# Altium project AMC_FMC_Carrier v4.PrjPcb (part 17 of 18)

## Sheet CPU.SchDoc: AMC FMC Carrier v4
size 420 x 297 mm; CompanyName: WUT; Organization: WUT ISE; Address1: Warsaw Univeristy of Technology; Address2: Nowowiejska 15/19 00-665 Warsaw; Address3: t.przywozki@gmail.com; Revision: 1; SheetNumber: 18; SheetTotal: 29; Project: AMC FMC Carrier v4; ModifiedBy: -; CheckedDate: -; Title2: MMC; DivGrp: ISE; Designer: T. Przywozki; ModifiedDate: -; ProjectName: ADC/DAC MEZZANINE
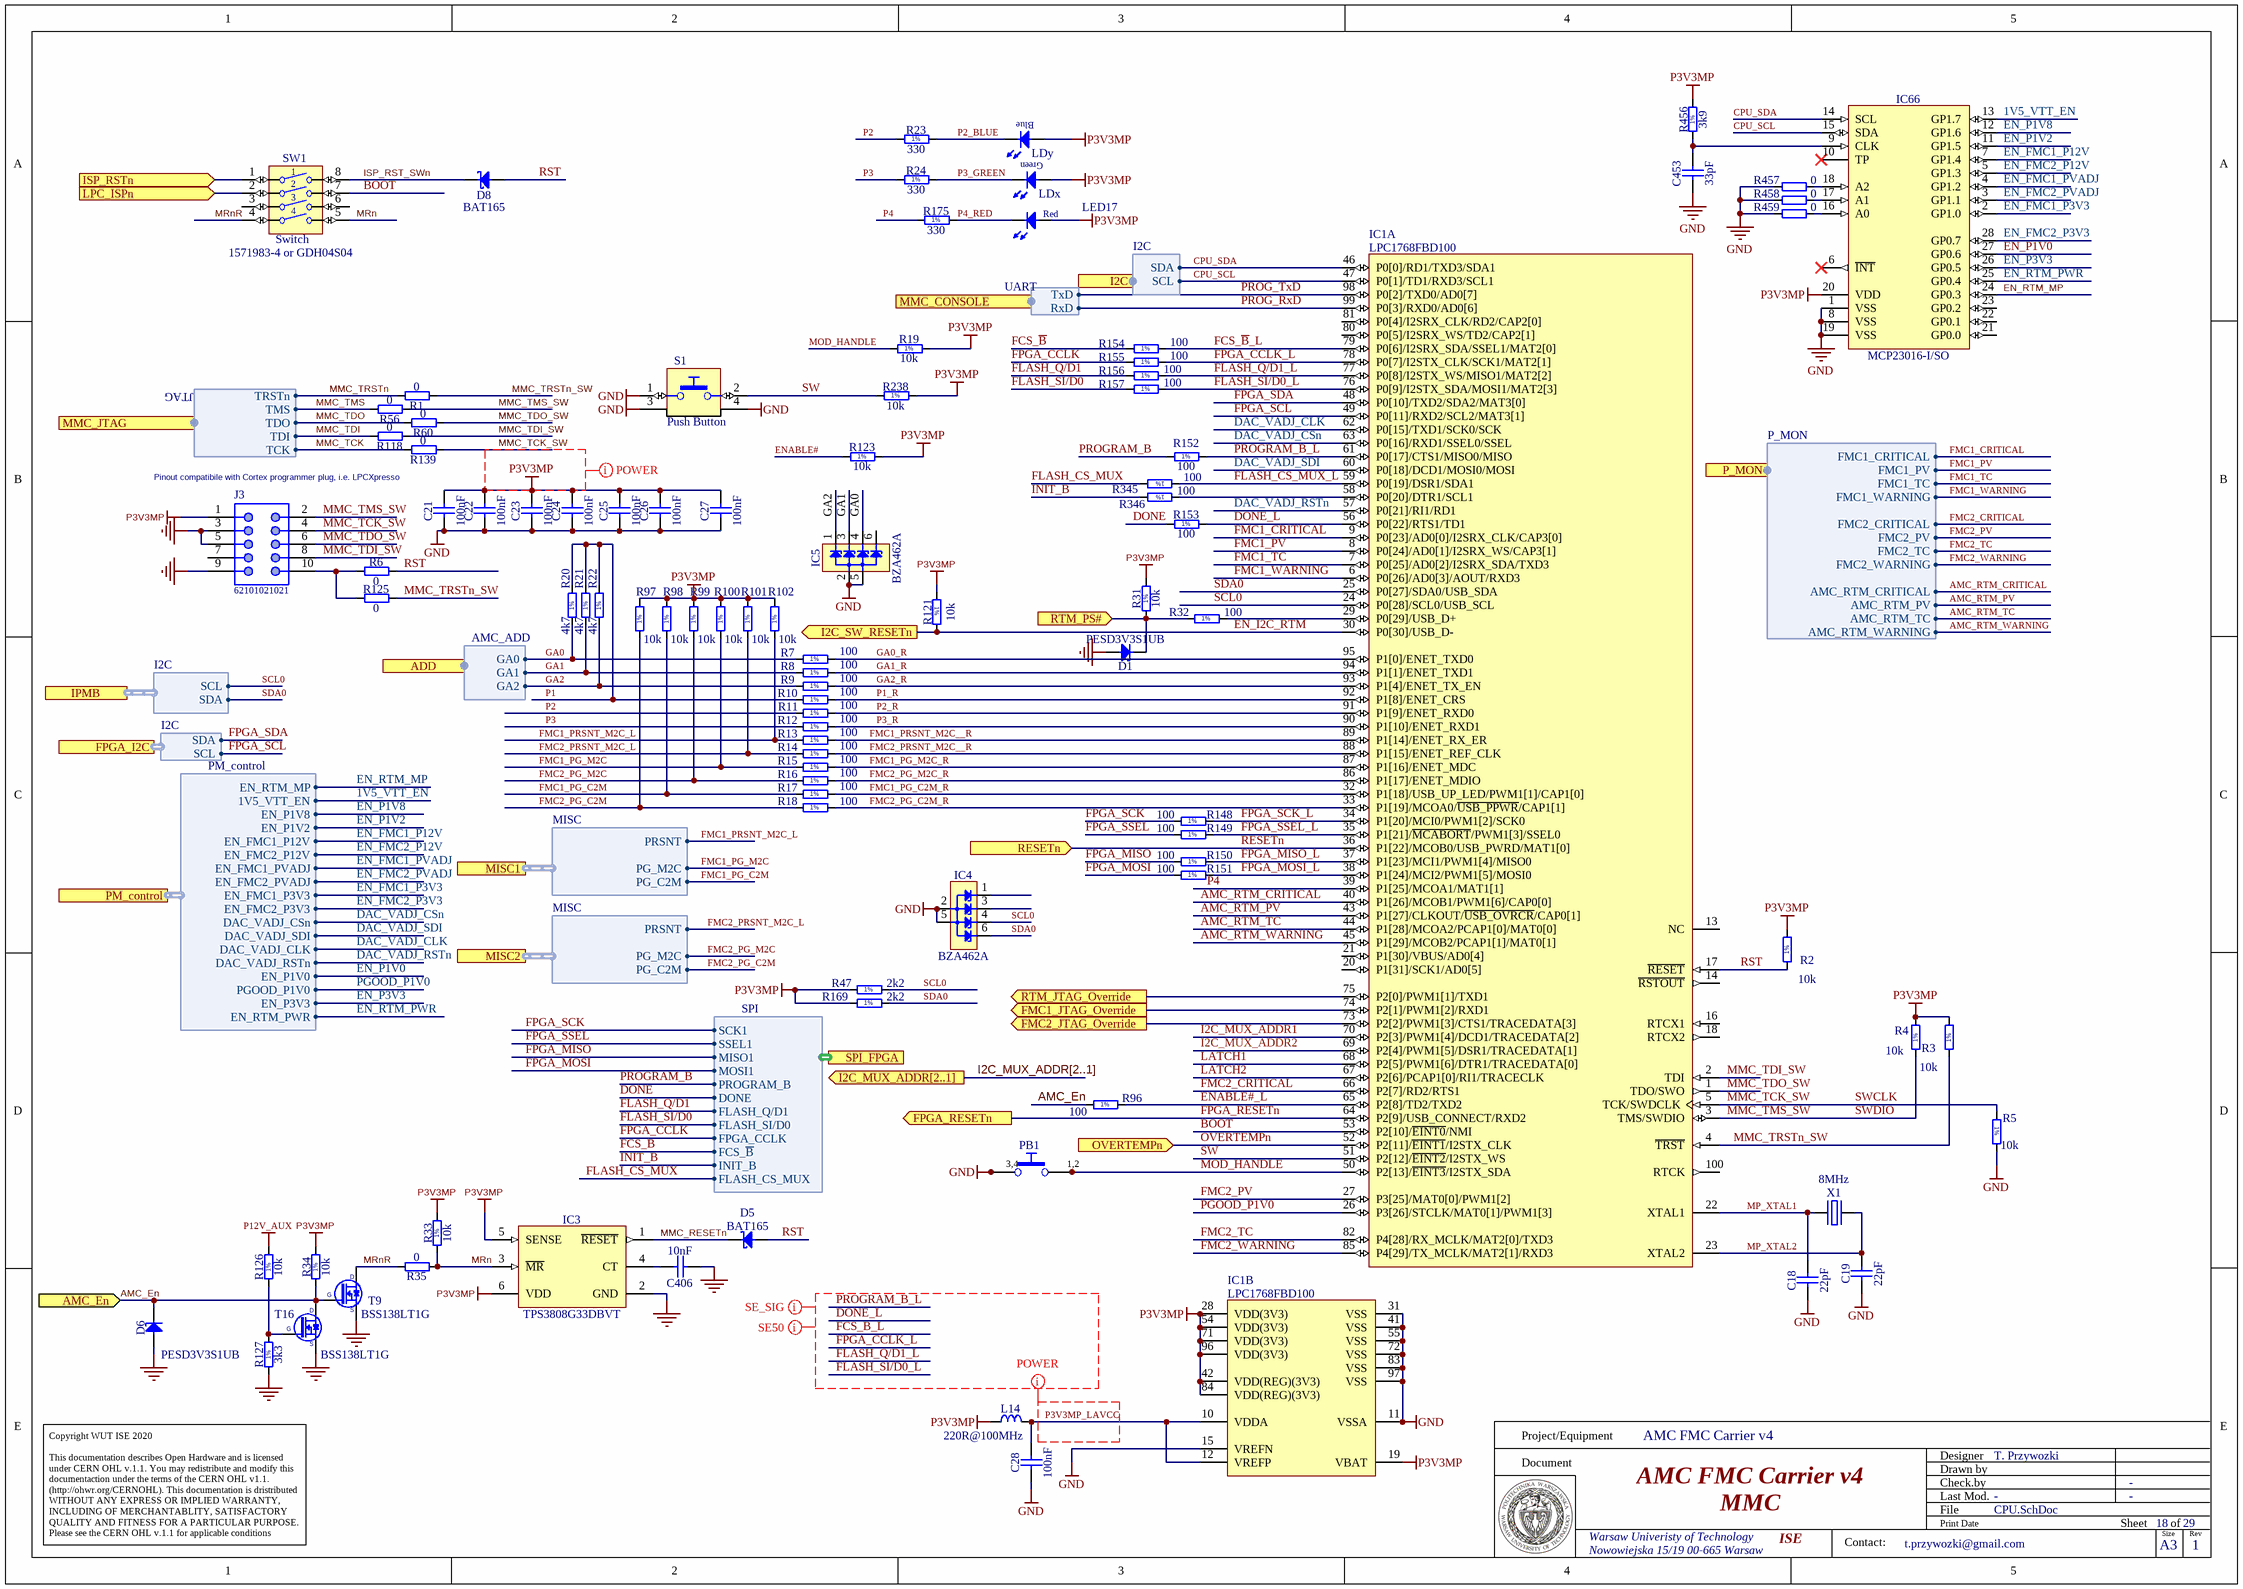
[diagram p30: CPU.SchDoc]

### Parts
(Parts that share a designator on the sheet are numbered #1, #2 ... from top to bottom, then left to right.)
C18  22pF  [CAPC1005X55N]
C19  22pF  [CAPC1005X55N]
C21  100nF  [CAPC0603X33N]
C22  100nF  [CAPC0603X33N]
C23  100nF  [CAPC0603X33N]
C24  100nF  [CAPC0603X33N]
C25  100nF  [CAPC0603X33N]
C26  100nF  [CAPC0603X33N]
C27  100nF  [CAPC0603X33N]
C28  100nF  [CAPC0603X33N]
C406  10nF  [CAPC1005X55N]
C453#2  33pF  [CAPC1005X55N]
D1  PESD3V3S1UB  [SODFL1608X65N]
D5  BAT165  [SOD2512X110N]
D6  PESD3V3S1UB  [SODFL1608X65N]
D8  BAT165  [SOD2512X110N]
IC1  LPC1768FBD100  [QFP50P1600X1600X160-100N]  (parts A,B of 2)
IC3  TPS3808G33DBVT  [SOT95P280X145-6N]
IC4  BZA462A  [SOT95P275X110-6N]
IC5  BZA462A  [SOT95P275X110-6N]
IC66  MCP23016-I/SO  [SOIC127P1030X265-28N]
J3  62101021021  [62101021021]
L14  220R@100MHz  [INDC2012X105N]
LDx  Green  [LED_AVAGO_HSME-C120rev]  (value not drawn)
LDy  Blue  [LED_AVAGO_HSME-C120rev]  (value not drawn)
LED17  Red  [LED_KINGBRIGHT_KPH-1608SURCK]
PB1  Push Button  [SW_C&K_HDT0001]  (value not drawn)
R1  0  [RESC1005X40N]
R2  10k  [RESC1005X40N]
R3  10k  [RESC1005X40N]
R4  10k  [RESC1005X40N]
R5  10k  [RESC1005X40N]
R6  0  [RESC1005X40N]
R7  100  [RESC1005X40N]
R8  100  [RESC1005X40N]
R9  100  [RESC1005X40N]
R10  100  [RESC1005X40N]
R11  100  [RESC1005X40N]
R12  100  [RESC1005X40N]
R13  100  [RESC1005X40N]
R14  100  [RESC1005X40N]
R15  100  [RESC1005X40N]
R16  100  [RESC1005X40N]
R17  100  [RESC1005X40N]
R18  100  [RESC1005X40N]
R19  10k  [RESC1005X40N]
R20  4k7  [RESC1005X40N]
R21  4k7  [RESC1005X40N]
R22  4k7  [RESC1005X40N]
R23  330  [RESC1005X40N]
R24  330  [RESC1005X40N]
R31  10k  [RESC1005X40N]
R32  100  [RESC1005X40N]
R33  10k  [RESC1005X40N]
R34  10k  [RESC1005X40N]
R35  0  [RESC1005X40N]
R47  2k2  [RESC1005X40N]
R56  0  [RESC1005X40N]
R60  0  [RESC1005X40N]
R96  100  [RESC1005X40N]
R97  10k  [RESC1005X40N]
R98  10k  [RESC1005X40N]
R99  10k  [RESC1005X40N]
R100  10k  [RESC1005X40N]
R101  10k  [RESC1005X40N]
R102  10k  [RESC1005X40N]
R118  0  [RESC1005X40N]
R121  10k  [RESC1005X40N]
R123  10k  [RESC1005X40N]
R125  0  [RESC1005X40N]
R126  10k  [RESC1005X40N]
R127  3k3  [RESC1608X55N]
R139  0  [RESC1005X40N]
R148  100  [RESC1005X40N]
R149  100  [RESC1005X40N]
R150  100  [RESC1005X40N]
R151  100  [RESC1005X40N]
R152  100  [RESC1005X40N]
R153  100  [RESC1005X40N]
R154  100  [RESC1005X40N]
R155  100  [RESC1005X40N]
R156  100  [RESC1005X40N]
R157  100  [RESC1005X40N]
R169  2k2  [RESC1005X40N]
R175  330  [RESC1005X40N]
R238  10k  [RESC1005X40N]
R345  100  [RESC1005X40N]
R346  100  [RESC1005X40N]
R456  3k9  [RESC1005X40N]
R457  0  [RESC1005X40N]
R458  0  [RESC1005X40N]
R459  0  [RESC1005X40N]
S1  Push Button  [PB_ALPS_SKHHLQA010]
SW1  Switch  Manufacturer Part Number: 1571983-4 or GDH04S04  [SW_TYCO_1571983-4]
T9  BSS138LT1G  [SOT95P240X110-3N]
T16  BSS138LT1G  [SOT95P240X110-3N]
X1  8MHz  [XTAL_TXC_7A]

### Ports
ADD (harness AMC_ADD), AMC_En (in), FMC1_JTAG_Override (out), FMC2_JTAG_Override (out), FPGA_I2C (harness I2C), FPGA_RESETn (out), I2C (harness I2C), I2C_MUX_ADDR[2..1] (out), I2C_SW_RESETn (out), IPMB (harness I2C), ISP_RSTn (in), LPC_ISPn (in), MISC1 (harness MISC), MISC2 (harness MISC), MMC_CONSOLE (harness UART), MMC_JTAG (harness JTAG), OVERTEMPn (in), P_MON (harness P_MON), PM_control (harness PM_control), RESETn (in), RTM_JTAG_Override (out), RTM_PS# (in), SPI_FPGA (harness SPI)

### Harnesses
SPI: SCK1, SSEL1, MISO1, MOSI1, FLASH_Q/D1, FLASH_SI/D0, PROGRAM_B, DONE, FPGA_CCLK, FCS_~{B}, INIT_B, FLASH_CS_MUX
PM_control: EN_P1V8, EN_P1V2, EN_FMC1_P12V, EN_FMC2_P12V, EN_FMC1_PVADJ, EN_FMC2_PVADJ, EN_FMC1_P3V3, EN_FMC2_P3V3, DAC_VADJ_CSn, DAC_VADJ_SDI, DAC_VADJ_CLK, DAC_VADJ_RSTn, 1V5_VTT_EN, EN_P1V0, PGOOD_P1V0, EN_P3V3, EN_RTM_PWR, EN_RTM_MP
I2C: SCL, SDA
MISC: PRSNT, PG_M2C, PG_C2M
AMC_ADD: GA0, GA1, GA2
JTAG: TCK, TDI, TDO, TMS, TRSTn
UART: RxD, TxD
P_MON: FMC1_CRITICAL, FMC1_TC, FMC1_WARNING, AMC_RTM_CRITICAL, FMC2_WARNING, AMC_RTM_PV, FMC2_CRITICAL, AMC_RTM_TC, FMC2_PV, AMC_RTM_WARNING, FMC2_TC, FMC1_PV

### Nets
GND: C18.1 C19.1 C21.1 C22.1 C23.1 C24.1 C25.1 C26.1 C27.1 C28.2 C406.1 C453#2.1 D1.2(A) D6.2(A) IC1.11(VSSA) IC1.15(VREFN) IC1.31(VSS) IC1.41(VSS) IC1.55(VSS) IC1.72(VSS) IC1.83(VSS) IC1.97(VSS) IC3.2(GND) IC4.2(A) IC4.5(A) IC5.2(A) IC5.5(A) IC66.1(VSS) IC66.8(VSS) IC66.19(VSS) J3.3 J3.5 J3.9 PB1.3 PB1.4 R5.1 R127.1 R457.1 R458.1 R459.1 S1.1 S1.3 S1.4 T9.2(S) T16.2(S)
P3V3MP: C21.2 C22.2 C23.2 C24.2 C25.2 C26.2 C27.2 IC1.19(VBAT) IC1.28(VDD(3V3)) IC1.42(VDD(REG)(3V3)) IC1.54(VDD(3V3)) IC1.71(VDD(3V3)) IC1.84(VDD(REG)(3V3)) IC1.96(VDD(3V3)) IC3.5(SENSE) IC3.6(VDD) IC66.20(VDD) J3.1 L14.2 LDx.1(A) LDy.1(A) LED17.2(A) R2.2 R3.2 R4.2 R19.2 R31.2 R33.2 R34.2 R47.1 R97.2 R98.2 R99.2 R100.2 R101.2 R102.2 R121.1 R123.2 R169.1 R238.2 R456.2
P12V_AUX: R126.2
1V5_VTT_EN: IC66.13(GP1.7) ; port PM_control.1V5_VTT_EN  [project net PM.1V5_VTT_EN]
AMC_En: D6.1(C) R34.1 R96.1 T9.1(G) T16.3(D) ; port AMC_En  [project net SCN_ENn]
AMC_RTM_CRITICAL: IC1.40(P1[26]/MCOB1/PWM1[6]/CAP0[0]) ; port P_MON.AMC_RTM_CRITICAL
AMC_RTM_PV: IC1.43(P1[27]/CLKOUT/~{USB_OVRCR}/CAP0[1]) ; port P_MON.AMC_RTM_PV
AMC_RTM_TC: IC1.44(P1[28]/MCOA2/PCAP1[0]/MAT0[0]) ; port P_MON.AMC_RTM_TC
AMC_RTM_WARNING: IC1.45(P1[29]/MCOB2/PCAP1[1]/MAT0[1]) ; port P_MON.AMC_RTM_WARNING
BOOT: IC1.53(P2[10]/~{EINT0}/NMI) SW1.7
CPU_SCL: IC1.47(P0[1]/TD1/RXD3/SCL1) IC66.15(SDA) ; port I2C.SCL  [project net I2C_CPU.SCL]
CPU_SDA: IC1.46(P0[0]/RD1/TXD3/SDA1) IC66.14(SCL) ; port I2C.SDA  [project net I2C_CPU.SDA]
DAC_VADJ_CLK: IC1.62(P0[15]/TXD1/SCK0/SCK) ; port PM_control.DAC_VADJ_CLK  [project net PM.DAC_VADJ_CLK]
DAC_VADJ_CSn: IC1.63(P0[16]/RXD1/SSEL0/SSEL) ; port PM_control.DAC_VADJ_CSn  [project net PM.DAC_VADJ_CSn]
DAC_VADJ_RSTn: IC1.57(P0[21]/RI1/RD1) ; port PM_control.DAC_VADJ_RSTn  [project net PM.DAC_VADJ_RSTn]
DAC_VADJ_SDI: IC1.60(P0[18]/DCD1/MOSI0/MOSI) ; port PM_control.DAC_VADJ_SDI  [project net PM.DAC_VADJ_SDI]
DONE: R153.2 ; port SPI_FPGA.DONE  [project net FSPI.DONE]
DONE_L: IC1.56(P0[22]/RTS1/TD1) R153.1
EN_FMC1_P3V3: IC66.2(GP1.0) ; port PM_control.EN_FMC1_P3V3  [project net PM.EN_FMC1_P3V3]
EN_FMC1_P12V: IC66.7(GP1.4) ; port PM_control.EN_FMC1_P12V  [project net PM.EN_FMC1_P12V]
EN_FMC1_PVADJ: IC66.4(GP1.2) ; port PM_control.EN_FMC1_PVADJ  [project net PM.EN_FMC1_PVADJ]
EN_FMC2_P3V3: IC66.28(GP0.7) ; port PM_control.EN_FMC2_P3V3  [project net PM.EN_FMC2_P3V3]
EN_FMC2_P12V: IC66.5(GP1.3) ; port PM_control.EN_FMC2_P12V  [project net PM.EN_FMC2_P12V]
EN_FMC2_PVADJ: IC66.3(GP1.1) ; port PM_control.EN_FMC2_PVADJ  [project net PM.EN_FMC2_PVADJ]
EN_I2C_RTM: IC1.30(P0[30]/USB_D-) R121.2 ; port I2C_SW_RESETn
EN_P1V0: IC66.27(GP0.6) ; port PM_control.EN_P1V0  [project net PM.EN_P1V0]
EN_P1V2: IC66.11(GP1.5) ; port PM_control.EN_P1V2  [project net PM.EN_P1V2]
EN_P1V8: IC66.12(GP1.6) ; port PM_control.EN_P1V8  [project net PM.EN_P1V8]
EN_P3V3: IC66.26(GP0.5) ; port PM_control.EN_P3V3  [project net PM.EN_P3V3]
EN_RTM_MP: IC66.24(GP0.3) ; port PM_control.EN_RTM_MP  [project net PM.EN_RTM_MP]
EN_RTM_PWR: IC66.25(GP0.4) ; port PM_control.EN_RTM_PWR  [project net PM.EN_RTM_PWR]
ENABLE#: R123.1
ENABLE#_L: IC1.65(P2[8]/TD2/TXD2) R96.2
FCS_~{B}: R154.1 ; port SPI_FPGA.FCS_~{B}  [project net FSPI.FCS_~{B}]
FCS_~{B}_L: IC1.79(P0[6]/I2SRX_SDA/SSEL1/MAT2[0]) R154.2
FLASH_CS_MUX: R345.1 ; port SPI_FPGA.FLASH_CS_MUX  [project net FSPI.FLASH_CS_MUX]
FLASH_CS_MUX_L: IC1.59(P0[19]/DSR1/SDA1) R345.2
FLASH_Q/D1: R156.1 ; port SPI_FPGA.FLASH_Q/D1  [project net FSPI.FLASH_Q/D1]
FLASH_Q/D1_L: IC1.77(P0[8]/I2STX_WS/MISO1/MAT2[2]) R156.2
FLASH_SI/D0: R157.1 ; port SPI_FPGA.FLASH_SI/D0  [project net FSPI.FLASH_SI/D0]
FLASH_SI/D0_L: IC1.76(P0[9]/I2STX_SDA/MOSI1/MAT2[3]) R157.2
FMC1_CRITICAL: IC1.9(P0[23]/AD0[0]/I2SRX_CLK/CAP3[0]) ; port P_MON.FMC1_CRITICAL
FMC1_JTAG_Override: IC1.74(P2[1]/PWM1[2]/RXD1) ; port FMC1_JTAG_Override
FMC1_PG_C2M: R17.1 R98.1 ; port MISC1.PG_C2M  [project net MISC1.PG_C2M]
FMC1_PG_C2M_R: IC1.32(P1[18]/USB_UP_LED/PWM1[1]/CAP1[0]) R17.2
FMC1_PG_M2C: R15.1 R100.1 ; port MISC1.PG_M2C  [project net MISC1.PG_M2C]
FMC1_PG_M2C_R: IC1.87(P1[16]/ENET_MDC) R15.2
FMC1_PRSNT_M2C__R: IC1.89(P1[14]/ENET_RX_ER) R13.2
FMC1_PRSNT_M2C_L: R13.1 R102.1 ; port MISC1.PRSNT  [project net MISC1.PRSNT]
FMC1_PV: IC1.8(P0[24]/AD0[1]/I2SRX_WS/CAP3[1]) ; port P_MON.FMC1_PV
FMC1_TC: IC1.7(P0[25]/AD0[2]/I2SRX_SDA/TXD3) ; port P_MON.FMC1_TC
FMC1_WARNING: IC1.6(P0[26]/AD0[3]/AOUT/RXD3) ; port P_MON.FMC1_WARNING
FMC2_CRITICAL: IC1.66(P2[7]/RD2/RTS1) ; port P_MON.FMC2_CRITICAL
FMC2_JTAG_Override: IC1.73(P2[2]/PWM1[3]/CTS1/TRACEDATA[3]) ; port FMC2_JTAG_Override
FMC2_PG_C2M: R18.1 R97.1 ; port MISC2.PG_C2M  [project net MISC2.PG_C2M]
FMC2_PG_C2M_R: IC1.33(P1[19]/MCOA0/~{USB_PPWR}/CAP1[1]) R18.2
FMC2_PG_M2C: R16.1 R99.1 ; port MISC2.PG_M2C  [project net MISC2.PG_M2C]
FMC2_PG_M2C_R: IC1.86(P1[17]/ENET_MDIO) R16.2
FMC2_PRSNT_M2C__R: IC1.88(P1[15]/ENET_REF_CLK) R14.2
FMC2_PRSNT_M2C_L: R14.1 R101.1 ; port MISC2.PRSNT  [project net MISC2.PRSNT]
FMC2_PV: IC1.27(P3[25]/MAT0[0]/PWM1[2]) ; port P_MON.FMC2_PV
FMC2_TC: IC1.82(P4[28]/RX_MCLK/MAT2[0]/TXD3) ; port P_MON.FMC2_TC
FMC2_WARNING: IC1.85(P4[29]/TX_MCLK/MAT2[1]/RXD3) ; port P_MON.FMC2_WARNING
FPGA_CCLK: R155.1 ; port SPI_FPGA.FPGA_CCLK  [project net FSPI.FPGA_CCLK]
FPGA_CCLK_L: IC1.78(P0[7]/I2STX_CLK/SCK1/MAT2[1]) R155.2
FPGA_MISO: R150.2 ; port SPI_FPGA.MISO1  [project net FSPI.MISO1]
FPGA_MISO_L: IC1.37(P1[23]/MCI1/PWM1[4]/MISO0) R150.1
FPGA_MOSI: R151.2 ; port SPI_FPGA.MOSI1  [project net FSPI.MOSI1]
FPGA_MOSI_L: IC1.38(P1[24]/MCI2/PWM1[5]/MOSI0) R151.1
FPGA_RESETn: IC1.64(P2[9]/USB_CONNECT/RXD2) ; port FPGA_RESETn
FPGA_SCK: R148.2 ; port SPI_FPGA.SCK1  [project net FSPI.SCK1]
FPGA_SCK_L: IC1.34(P1[20]/MCI0/PWM1[2]/SCK0) R148.1
FPGA_SCL: IC1.49(P0[11]/RXD2/SCL2/MAT3[1]) ; port FPGA_I2C.SCL  [project net FPGA_I2C_SCL]
FPGA_SDA: IC1.48(P0[10]/TXD2/SDA2/MAT3[0]) ; port FPGA_I2C.SDA  [project net FPGA_I2C_SDA]
FPGA_SSEL: R149.2 ; port SPI_FPGA.SSEL1  [project net FSPI.SSEL1]
FPGA_SSEL_L: IC1.35(P1[21]/~{MCABORT}/PWM1[3]/SSEL0) R149.1
GA0: IC5.4(C3) R7.1 R20.1 ; port ADD.GA0  [project net ADD.GA0]
GA0_R: IC1.95(P1[0]/ENET_TXD0) R7.2
GA1: IC5.3(C2) R8.1 R21.1 ; port ADD.GA1  [project net ADD.GA1]
GA1_R: IC1.94(P1[1]/ENET_TXD1) R8.2
GA2: IC5.1(C1) R9.1 R22.1 ; port ADD.GA2  [project net ADD.GA2]
GA2_R: IC1.93(P1[4]/ENET_TX_EN) R9.2
I2C_MUX_ADDR1: IC1.70(P2[3]/PWM1[4]/DCD1/TRACEDATA[2])
I2C_MUX_ADDR2: IC1.69(P2[4]/PWM1[5]/DSR1/TRACEDATA[1])
INIT_B: R346.1 ; port SPI_FPGA.INIT_B  [project net FSPI.INIT_B]
ISP_RST_SWn: D8.1(C) SW1.8
ISP_RSTn: SW1.1 ; port ISP_RSTn
LATCH1: IC1.68(P2[5]/PWM1[6]/DTR1/TRACEDATA[0])
LATCH2: IC1.67(P2[6]/PCAP1[0]/RI1/TRACECLK)
LPC_ISPn: SW1.2 ; port LPC_ISPn
MMC_RESETn: D5.1(C) IC3.1(~{RESET})
MMC_TCK: R139.2 ; port MMC_JTAG.TCK
MMC_TCK_SW: IC1.5(TCK/SWDCLK) J3.4 R5.2 R139.1  [also labelled SWCLK]
MMC_TDI: R118.2 ; port MMC_JTAG.TDI
MMC_TDI_SW: IC1.2(TDI) J3.8 R118.1
MMC_TDO: R60.2 ; port MMC_JTAG.TDO
MMC_TDO_SW: IC1.1(TDO/SWO) J3.6 R60.1
MMC_TMS: R56.2 ; port MMC_JTAG.TMS
MMC_TMS_SW: IC1.3(TMS/SWDIO) J3.2 R4.1 R56.1  [also labelled SWDIO]
MMC_TRSTn: R1.2 ; port MMC_JTAG.TRSTn
MMC_TRSTn_SW: IC1.4(~{TRST}) R1.1 R3.1 R125.2
MOD_HANDLE: IC1.50(P2[13]/~{EINT3}/I2STX_SDA) PB1.1 PB1.2 R19.1
MP_XTAL1: C18.2 IC1.22(XTAL1) X1.1(OSC1)
MP_XTAL2: C19.2 IC1.23(XTAL2) X1.2(OSC2)
MRn: IC3.3(~{MR}) R33.1 R35.1 SW1.5
MRnR: R35.2 SW1.4 T9.3(D)
OVERTEMPn: IC1.52(P2[11]/~{EINT1}/I2STX_CLK) ; port OVERTEMPn
P1: R10.1 R20.2 R21.2 R22.2
P1_R: IC1.92(P1[8]/ENET_CRS) R10.2
P2: R11.1 R23.1
P2_BLUE: LDy.2(C) R23.2
P2_R: IC1.91(P1[9]/ENET_RXD0) R11.2
P3: R12.1 R24.1
P3_GREEN: LDx.2(C) R24.2
P3_R: IC1.90(P1[10]/ENET_RXD1) R12.2
P3V3MP_LAVCC: C28.1 IC1.10(VDDA) IC1.12(VREFP) L14.1
P4: IC1.39(P1[25]/MCOA1/MAT1[1]) R175.1
P4_RED: LED17.1(C) R175.2
PGOOD_P1V0: IC1.26(P3[26]/STCLK/MAT0[1]/PWM1[3]) ; port PM_control.PGOOD_P1V0  [project net PM.PGOOD_P1V0]
PROG_RxD: IC1.99(P0[3]/RXD0/AD0[6]) ; port MMC_CONSOLE.RxD  [project net MMC_CONS_PROG_RxD]
PROG_TxD: IC1.98(P0[2]/TXD0/AD0[7]) ; port MMC_CONSOLE.TxD  [project net MMC_CONS_PROG_TxD]
PROGRAM_B: R152.2 ; port SPI_FPGA.PROGRAM_B  [project net FSPI.PROGRAM_B]
PROGRAM_B_L: IC1.61(P0[17]/CTS1/MISO0/MISO) R152.1
RESETn: IC1.36(P1[22]/MCOB0/USB_PWRD/MAT1[0]) ; port RESETn
RST: D5.2(A) D8.2(A) IC1.17(~{RESET}) R2.1 R6.2
RTM_JTAG_Override: IC1.75(P2[0]/PWM1[1]/TXD1) ; port RTM_JTAG_Override
RTM_PS#: D1.1(C) R31.1 R32.2 ; port RTM_PS#
SCL0: IC1.24(P0[28]/SCL0/USB_SCL) IC4.4(C3) R47.2 ; port IPMB.SCL  [project net IPMB.SCL]
SDA0: IC1.25(P0[27]/SDA0/USB_SDA) IC4.6(C4) R169.2 ; port IPMB.SDA  [project net IPMB.SDA]
SW: IC1.51(P2[12]/~{EINT2}/I2STX_WS) R238.1 S1.2
NetC406_2: C406.2 IC3.4(CT)
NetC453#2_2: C453#2.2 IC66.9(CLK) R456.1
NetIC1_29: IC1.29(P0[29]/USB_D+) R32.1
NetIC1_58: IC1.58(P0[20]/DTR1/SCL1) R346.2
NetIC66_16: IC66.16(A0) R459.2
NetIC66_17: IC66.17(A1) R458.2
NetIC66_18: IC66.18(A2) R457.2
NetJ3_10: J3.10 R6.1 R125.1
NetR126_1: R126.1 R127.2 T16.1(G)

Not connected (* = marked no-connect by the designer): IC1 13(NC) 14(~{RSTOUT}) 16(RTCX1) 18(RTCX2) 20(P1[31]/SCK1/AD0[5]) 21(P1[30]/VBUS/AD0[4]) 80(P0[5]/I2SRX_WS/TD2/CAP2[1]) 81(P0[4]/I2SRX_CLK/RD2/CAP2[0]) 100(RTCK); IC4 1(C1) 3(C2); IC5 6(C4); IC66 6(~{INT})* 10(TP)* 21(GP0.0) 22(GP0.1) 23(GP0.2); J3 7; SW1 3 6

### Buses and harness runs
bus I2C_MUX_ADDR[2..1] = port I2C_MUX_ADDR[2..1]

### Layout directives
net class POWER: MMC_TCK_SW, P3V3MP, P3V3MP_LAVCC
net class SE_SIG: DONE_L, FCS_~{B}_L, FLASH_Q/D1_L, FLASH_SI/D0_L, FPGA_CCLK_L, PROGRAM_B_L
net class SE50: DONE_L, FCS_~{B}_L, FLASH_Q/D1_L, FLASH_SI/D0_L, FPGA_CCLK_L, PROGRAM_B_L

### Notes on the sheet
- Pinout compatibile with Cortex programmer plug, i.e. LPCXpresso
- Project/Equipment
- Document
- Designer
- Drawn by
- Check.by
- Copyright WUT ISE 2020
  This documentation describes Open Hardware and is licensed under CERN OHL v.1.1. You may redistribute and modify this documentaction under the terms of the CERN OHL v1.1.
  (http://ohwr.org/CERNOHL). This documentation is dristributed WITHOUT ANY EXPRESS OR IMPLIED WARRANTY, INCLUDING OF MERCHANTABLITY, SATISFACTORY QUALITY AND FITNESS FOR A PARTICULAR PURPOSE. Please see the CERN OHL v.1.1 for applicable conditions
- File
- Last Mod.
- Print Date
- Sheet
- Size
- A3
- of
- Rev
- Contact:
- (in symbol R0402_2K2_1%_0.0625W_100PPM) 1%
- (in symbol R0402_3K9_1%_0.0625W_100PPM) 1%
- (in symbol R0402_4K7_1%_0.0625W_100PPM) 1%
- (in symbol R0402_10K_1%_0.0625W_100PPM) 1%
- (in symbol R0402_100R_1%_0.1W_100PPM) 1%
- (in symbol R0402_100R_1%_0.0625W_100PPM) 1%
- (in symbol R0402_330R_1%_0.0625W_100PPM) 1%
- (in symbol R0603_3K3_1%_0.1W_100PPM) 1%
- (in symbol SW_C&K_HDT0001) 3,4; 1,2

### Library data of the parts
C18 C19 = CC0402_22PF_50V_5%_NP0: Non-polarised capacitor; Part Description: SMD Multilayer Chip Ceramic Capacitor; Manufacturer: GENERIC; Manufacturer1 Part Number: 223886915229; Voltage: 50V; TC: NP0; Tolerance: ±5%; Table: Capacitors SMD; Part Number: CC0402_22PF_50V_5%_NP0; Component Kind: Standard; Component Type: Standard; Pin Count: 2; Value: 22pF; Status: Not Recommended; Manufacturer Part Number: CC0402_22PF_50V_5%_NP0; Case: 0402; Mounted: Yes; Socket: No; SMD: Yes; Manufacturer1 Example: PHYCOMP; Manufacturer1 ComponentHeight: 0.55mm; HelpURL: \\cern.ch\dfs\Applications\Altium\Datasheets\CC0402_NP0_PHYCOMP.pdf; Author: CERN DEM JLC; CreateDate: 2007-12-03; LatestRevisionDate: 2007-12-03
C21-C28 = CC0201_100NF_6.3V_10%_X5R: as C313-C317 on sheet Thermometers; Part Number: CC0201_100NF_6.3V_10%_X5R; Component Kind: Standard; Component Type: Standard; Pin Count: 2; Value: 100nF; Status: Not Recommended; Manufacturer Part Number: CC0201_100NF_6.3V_10%_X5R; Case: 0201; Mounted: Yes; Socket: No; SMD: Yes; Manufacturer1 Example: AVX; Manufacturer1 ComponentHeight: 0.33mm; HelpURL: \\cern.ch\dfs\Applications\Altium\Datasheets\CC0201_X5R_AVX.pdf; Author: CERN DEM JLC; CreateDate: 2007-12-03; LatestRevisionDate: 2007-12-03
C406 = CC0402_10NF_16V_10%_X7R: Non-polarised capacitor; Manufacturer: GENERIC; Part Description: SMD Multilayer Chip Ceramic Capacitor; Manufacturer1 Part Number: 223878715636; Tolerance: ±10%; Voltage: 16V; TC: X7R; Manufacturer Part Number: CC0402_10NF_16V_10%_X7R; Part Number: CC0402_10NF_16V_10%_X7R; Value: 10nF; Component Kind: Standard; Component Type: Standard; Pin Count: 2; Status: Not Recommended; Case: 0402; Mounted: Yes; Socket: No; SMD: Yes; Sense: No; Manufacturer1 Example: PHYCOMP; Manufacturer1 ComponentHeight: 0.55mm; HelpURL: \\cern.ch\dfs\Applications\Altium\Datasheets\CC0402_X7R_PHYCOMP.pdf; Author: CERN DEM JLC; CreateDate: 03.12.2007; LatestRevisionDate: 03.12.2007
C453#2 = CC0402_33PF_50V_5%_C0G: Non-polarised capacitor; Part Description: SMD Multilayer Chip Ceramic Capacitor; Manufacturer: GENERIC; Manufacturer1 Part Number: C0402C330J5GACTU; Voltage: 50V; TC: C0G/NP0; Tolerance: ±5%; Part Number: CC0402_33PF_50V_5%_C0G; Component Kind: Standard; Component Type: Standard; Pin Count: 2; Value: 33pF; Status: Preferred; Manufacturer Part Number: CC0402_33PF_50V_5%_C0G; Case: 0402; Mounted: Yes; Socket: No; SMD: Yes; Sense: No; Manufacturer1 Example: KEMET; Manufacturer1 ComponentHeight: 0.55mm; HelpURL: \\cern.ch\dfs\Applications\Altium\Datasheets\CC0402_C0G_KEMET_(Commercial Grade).pdf; Author: CERN DEM JLC; CreateDate: 03.12.2007; LatestRevisionDate: 22.04.2015
D1 D6 = PESD3V3S1UB: ESD protection diode; Manufacturer: NXP SEMICONDUCTORS; Part Description: ESD protection diode (23kV); Voltage: 3V3; Power: 330W; PressFit: No; Bonding: No; Manufacturer Part Number: PESD3V3S1UB; PackageDescription: Ultra Small Outline Diode Flat Lead (SOD-523), Body; 1.2mm L X 0.8mm W X 0.65mm H, IPC Medium Density; Part Number: PESD3V3S1UB; Component Kind: Standard; Component Type: Standard; Device: PESD3V3S1UB; Pin Count: 2; Case: SOD523; Mounted: Yes; Socket: No; SMD: Yes; Sense: No; ComponentHeight: 0.65mm; HelpURL: \\cern.ch\dfs\Applications\Altium\Datasheets\PESD3V3S1UB.pdf; Author: CERN DEM JLC; CreateDate: 29.11.2012; LatestRevisionDate: 29.11.2012
D5 D8 = BAT165: Schottky Diode; Manufacturer: INFINEON; Part Description: Medium Power AF Schottky Diode; Voltage: 40V; Power: 750mA; PressFit: No; Bonding: No; Manufacturer Part Number: BAT165; PackageDescription: Small Outline Diode (SOD-323), 1.70mm W X 1.25mm L X 1.10mm H body,  IPC Medium Density; Part Number: BAT165; Component Kind: Standard; Component Type: Standard; Device: BAT165; Pin Count: 2; Case: SOD323; Mounted: Yes; Socket: No; SMD: Yes; Sense: No; ComponentHeight: 1.1mm; HelpURL: \\cern.ch\dfs\Applications\Altium\Datasheets\BAT165.pdf; Author: CERN DEM JLC; CreateDate: 12.11.2014; LatestRevisionDate: 12.11.2014
IC1 = LPC1768FBD100: LPC1768 Series 64kB 100MHz 32-Bit ARM Cortex-M3 Microcontroller; Part Description: 32-bit 100MHz ARM Cortex-M3 Microcontroller, 512kB Flash, 64kB SRAM, with Ethernet, USB 2.0 Host/Device/OTG, CAN; Manufacturer: NXP SEMICONDUCTORS; PressFit: No; Bonding: No; Part Number: LPC1768FBD100; Component Kind: Standard; Component Type: Standard; Device: LPC1768FBD100; PackageDescription: QFP, 0.50mm Pitch, Square; 100 Pin,14.00mm L X 14.00mm W X 1.60mm H Body, IPC Medium Density; Manufacturer Part Number: LPC1768FBD100; Pin Count: 100; Case: QFP100; Mounted: Yes; Socket: No; SMD: Yes; Sense: No; ComponentHeight: 1.6mm; HelpURL: \\cern.ch\dfs\Applications\Altium\Datasheets\LPC1768FBD100.pdf; Author: CERN DEM JLC; CreateDate: 06.10.2016; LatestRevisionDate: 06.10.2016
IC3 = TPS3808G33DBVT: Low Quiescent Current, Programmable-Delay Supervisory Circuit; Manufacturer: TEXAS INSTRUMENTS; Part Description: 3.3V, Low Quiescent Current, Programmable-Delay Supervisory Circuit; PressFit: No; Bonding: No; Manufacturer Part Number: TPS3808G33DBVT; PackageDescription: SOT23, 6-Leads, Body 1.6x3.0mm, Pitch 0.95mm, IPC Medium Density; Part Number: TPS3808G33DBVT; Component Kind: Standard; Component Type: Standard; Device: TPS3808G33DBVT; Pin Count: 6; Case: SOT23-6; Mounted: Yes; Socket: No; SMD: Yes; Sense: No; ComponentHeight: 1.45mm; Author: CERN DEM JLC; HelpURL: \\cern.ch\dfs\Applications\Altium\Datasheets\TPS3808G33DBVT.pdf; CreateDate: 05.11.2013; LatestRevisionDate: 05.11.2013
IC4 IC5 = BZA462A: Quadruple ESD Transient Voltage Suppressor; Manufacturer: NXP SEMICONDUCTORS; Voltage: 15kV; Power: 24W; PressFit: No; Bonding: No; Part Number: BZA462A; Component Kind: Standard; Component Type: Standard; Device: BZA462A; PackageDescription: SOT, 0.95mm Pitch; 6 Pin, 1.50mm W X 2.90mm L X 1.10mm H body, IPC Medium Density; Part Description: Quadruple ESD Transient Voltage Suppressor; Manufacturer Part Number: BZA462A; Pin Count: 3; Case: SOT23-6; Mounted: Yes; Socket: No; SMD: Yes; Sense: No; ComponentHeight: 1.1mm; HelpURL: \\cern.ch\dfs\Applications\Altium\Datasheets\BZA462A.pdf; Author: CERN DEM JLC; CreateDate: 09.11.2016; LatestRevisionDate: 09.11.2016
IC66 = MCP23016-I/SO: 16-bit I/O I2C I/O Expander; Part Description: 16-bit I2C I/O Expander; Manufacturer: MICROCHIP TECHNOLOGY; PressFit: No; Bonding: No; Part Number: MCP23016-I/SO; Component Kind: Standard; Component Type: Standard; Device: MCP23016-I/SO; PackageDescription: SOIC,1.27mm, Pitch;28 Pin, 7.50mm W X 17.90mm L X 2.65mm H body, IPC Medium Density; Manufacturer Part Number: MCP23016-I/SO; Pin Count: 28; Case: SOIC28; Mounted: Yes; Socket: No; SMD: Yes; Sense: No; ComponentHeight: 2.65mm; Author: CERN DEM JLC; HelpURL: \\cern.ch\dfs\Applications\Altium\Datasheets\MCP23016-I-SO.pdf; CreateDate: 13.08.2012; LatestRevisionDate: 14.08.2012
J3 = 62101021021: SMT Vertical Pin Header WR-PHD, Pitch 1.27 mm, Dual Row, 10 pins; Pin Number: 10; Pitch: 1.27 mm; Gender: Male; Rated Current: 1 A; Working Voltage: 100 VAC; Withstanding Voltage: 500 VAC; Contact Resistance: 20 mOhm; ComponentLink1Description: Manufacturer; ComponentLink1URL: http://www.we-online.de; ComponentLink2Description: Datasheet; ComponentLink2URL: https://katalog.we-online.de/em/datasheet/62101021021.pdf; Part Number: 62101021021; Published Date: August 2018; Publisher: Wurth Elektronik; Operating Temperature: -40 to 105 degC; Mounting Technology: SMT; Packaging: Tube; Row Number: Dual; Orientation: Vertical
L14 = IND0805_MURATA_BLM21PG221SN1D: Inductor; Part Description: SMD EMIFIL Suppression Chip Ferrite Bead; Manufacturer: MURATA; Power: 2A; Resistance: 0.05R; Tolerance: ±25%; Table: Inductors SMD; Part Number: IND0805_MURATA_BLM21PG221SN1D; Component Kind: Standard; Component Type: Standard; Pin Count: 2; Value: 220R@100MHz; Status: None; Manufacturer Part Number: BLM21PG221SN1D; Case: 0805; Mounted: Yes; Socket: No; SMD: Yes; ComponentHeight: 1.05mm; HelpURL: \\cern.ch\dfs\Applications\Altium\Datasheets\IND0402_MURATA_BLM21P.pdf; Author: CERN DEM JLC; CreateDate: 2010-01-25; LatestRevisionDate: 2010-01-25
LDx = LED_SMD_90deg_mini_G: LED Green Avago C120; Part Number: LED_AVAGO_HSME-C120; Part Description: High Performance Right Angle Chip Green LED; Manufacturer: AVAGO TECHNOLOGIES; Manufacturer Part Number: HSME-C120; Table: LEDs & Displays; Component Kind: Standard; Component Type: Standard; Color: Green; Footprint: LED_AVAGO_HSME-C120; PackageDescription: Green Chip LED, 2-Leads, Body 1.7x1.1mm, Side Emitting Package; Pin Count: 2; Mounted: Yes; Socket: No; SMD: Yes; ComponentHeight: 0.7mm; HelpURL: \\cern.ch\dfs\Applications\Altium\Datasheets\LED_AVAGO_HSME-C120.pdf; ComponentLink1URL: \\cern.ch\dfs\Applications\Altium\Datasheets\LED_AVAGO_HSME-C110_DESIGN-GUIDE.pdf; ComponentLink1Description: Design Guide; Author: CERN DEM JMW; CreateDate: 2009-07-22; LatestRevisionDate: 2012-06-20
LDy = LED_SMD_90deg_mini_B: LED Blue Avago C120; Part Number: LED_AVAGO_HSMR-C120; Part Description: High Performance Right Angle Chip Blue LED; Manufacturer: AVAGO TECHNOLOGIES; Manufacturer Part Number: HSMR-C120; Table: LEDs & Displays; Component Kind: Standard; Component Type: Standard; Color: Blue; Footprint: LED_AVAGO_HSMR-C120; PackageDescription: Blue Chip LED, 2-Leads, Body 1.7x1.1mm, Side Emitting Package; Pin Count: 2; Mounted: Yes; Socket: No; SMD: Yes; ComponentHeight: 0.7mm; HelpURL: \\cern.ch\dfs\Applications\Altium\Datasheets\LED_AVAGO_HSME-C120.pdf; ComponentLink1URL: \\cern.ch\dfs\Applications\Altium\Datasheets\LED_AVAGO_HSME-C110_DESIGN-GUIDE.pdf; ComponentLink1Description: Design Guide; Author: CERN DEM JMW; CreateDate: 2009-07-22; LatestRevisionDate: 2012-06-20
LED17 = LED_KINGBRIGHT_KPH-1608SURCK: LED Red 1C 2A; Part Description: SMD Hyper Red LED, Case 1.6mmX0.8mm(0603), 0.65mm Thickness; PressFit: No; Bonding: No; Part Number: LED_KINGBRIGHT_KPH-1608SURCK; Component Kind: Standard; Component Type: Standard; Color: Red; PackageDescription: SMT Hyper Red LED, Case 0603, Body L 1.6 x W 0.8mm H 0.65mm; Manufacturer: KINGBRIGHT; Manufacturer Part Number: KPH-1608SURCK; Pin Count: 2; Mounted: Yes; Socket: No; SMD: Yes; Sense: No; ComponentHeight: 0.65mm; HelpURL: \\cern.ch\dfs\Applications\Altium\Datasheets\LED_KINGBRIGHT_KPH-1608SURCK.pdf; Author: CERN DEM JLC; CreateDate: 03.07.2017; LatestRevisionDate: 03.07.2017
PB1 = SW_C&K_HDT0001: Push-Button Switch SPDT; Part Description: 5VDC 1mA SPST-NO Micro Mini Surface Surface Mount Detect Push-Button Switch, HDT Serie; Manufacturer: C&K; Table: Switches; Part Number: SW_C&K_HDT0001; Component Kind: Standard; Component Type: Standard; Pin Count: 4; PackageDescription: Body 3.5x2.8mm, Micro Mini Surface Mount Detect Switches, HDT Serie; Family: Push Button; Mounted: Yes; Socket: No; SMD: Yes; Status: None; Manufacturer Part Number: HDT0001; ComponentHeight: 3.35mm; HelpURL: \\cern.ch\dfs\Applications\Altium\Datasheets\SW_C&K_HDT0001.pdf; Author: CERN DEM JLC; CreateDate: 2012-08-15; LatestRevisionDate: 2012-08-15
R1 R6 R35 R56 R60 R118 R125 R139 R457-R459 = R0402_0R_JUMPER: as R410 on sheet I2C_MUX; Manufacturer Part Number: R0402_0R_JUMPER; Part Number: R0402_0R_JUMPER; Value: 0; Component Kind: Standard; Component Type: Standard; Pin Count: 2; Status: Not Recommended; Case: 0402; Mounted: Yes; Sense: No; Socket: No; SMD: Yes; Manufacturer1 Example: YAGEO PHYCOMP; Manufacturer1 ComponentHeight: 0.4mm; HelpURL: \\cern.ch\dfs\Applications\Altium\Datasheets\R0402_Phycomp_RC0402.pdf; Author: CERN DEM JLC; CreateDate: 03.12.2007; LatestRevisionDate: 17.10.2012
R2-R5 R19 R97-R102 R123 R238 = R0402_10K_1%_0.0625W_100PPM: as R222 on sheet Thermometers; Part Number: R0402_10K_1%_0.0625W_100PPM; Component Kind: Standard; Component Type: Standard; Pin Count: 2; Value: 10k; Status: Not recommended; Power: 0.0625W; Tolerance: ±1%; Manufacturer Part Number: R0402_10K_1%_0.0625W_100PPM; Case: 0402; Mounted: Yes; Socket: No; SMD: Yes; Manufacturer1 Example: YAGEO PHYCOMP; Manufacturer1 ComponentHeight: 0.4mm; HelpURL: \\cern.ch\dfs\Applications\Altium\Datasheets\R0402_Phycomp_RC0402.pdf; Author: CERN DEM JLC; CreateDate: 2007-12-03; LatestRevisionDate: 2012-10-17
R7-R18 R96 R148-R157 R345 R346 = R0402_100R_1%_0.0625W_100PPM: Resistor - 1%; Part Description: General Purpose Thick Film Chip Resistor; Manufacturer: GENERIC; Manufacturer1 Part Number: 232270671001L; TC: ±100ppm/°C; Table: Resistors SMD; Part Number: R0402_100R_1%_0.0625W_100PPM; Component Kind: Standard; Component Type: Standard; Pin Count: 2; Value: 100; Status: Not recommended; Power: 0.0625W; Tolerance: ±1%; Manufacturer Part Number: R0402_100R_1%_0.0625W_100PPM; Case: 0402; Mounted: Yes; Socket: No; SMD: Yes; Manufacturer1 Example: YAGEO PHYCOMP; Manufacturer1 ComponentHeight: 0.4mm; HelpURL: \\cern.ch\dfs\Applications\Altium\Datasheets\R0402_Phycomp_RC0402.pdf; Author: CERN DEM JLC; CreateDate: 2007-12-03; LatestRevisionDate: 2012-10-17
R20-R22 = R0402_4K7_1%_0.0625W_100PPM: Resistor - 1%; Part Description: General Purpose Thick Film Chip Resistor; Manufacturer: GENERIC; Manufacturer1 Part Number: 232270674702L; TC: ±100ppm/°C; Table: Resistors SMD; Part Number: R0402_4K7_1%_0.0625W_100PPM; Component Kind: Standard; Component Type: Standard; Pin Count: 2; Value: 4k7; Status: Not recommended; Power: 0.0625W; Tolerance: ±1%; Manufacturer Part Number: R0402_4K7_1%_0.0625W_100PPM; Case: 0402; Mounted: Yes; Socket: No; SMD: Yes; Manufacturer1 Example: YAGEO PHYCOMP; Manufacturer1 ComponentHeight: 0.4mm; HelpURL: \\cern.ch\dfs\Applications\Altium\Datasheets\R0402_Phycomp_RC0402.pdf; Author: CERN DEM JLC; CreateDate: 2007-12-03; LatestRevisionDate: 2012-10-17
R23 R24 R175 = R0402_330R_1%_0.0625W_100PPM: Resistor - 1%; Part Description: General Purpose Thick Film Chip Resistor; Manufacturer: GENERIC; Manufacturer1 Part Number: 232270673301L; TC: ±100ppm/°C; Table: Resistors SMD; Part Number: R0402_330R_1%_0.0625W_100PPM; Component Kind: Standard; Component Type: Standard; Pin Count: 2; Value: 330; Status: Not recommended; Power: 0.0625W; Tolerance: ±1%; Manufacturer Part Number: R0402_330R_1%_0.0625W_100PPM; Case: 0402; Mounted: Yes; Socket: No; SMD: Yes; Manufacturer1 Example: YAGEO PHYCOMP; Manufacturer1 ComponentHeight: 0.4mm; HelpURL: \\cern.ch\dfs\Applications\Altium\Datasheets\R0402_Phycomp_RC0402.pdf; Author: CERN DEM JLC; CreateDate: 2007-12-03; LatestRevisionDate: 2012-10-17
R31 R33 R34 R121 R126 = R0402_10K_1%_0.0625W_100PPM: Resistor - 1%; Manufacturer: GENERIC; Part Description: General Purpose Thick Film Chip Resistor; Manufacturer1 Part Number: 232270671003L; TC: ±100ppm/°C; PressFit: No; Manufacturer Part Number: R0402_10K_1%_0.0625W_100PPM; Part Number: R0402_10K_1%_0.0625W_100PPM; Tolerance: ±1%; Value: 10k; Component Kind: Standard; Component Type: Standard; Pin Count: 2; Status: Not Recommended; Power: 0.0625W; Case: 0402; Mounted: Yes; Sense: No; Socket: No; SMD: Yes; Manufacturer1 Example: YAGEO PHYCOMP; Manufacturer1 ComponentHeight: 0.4mm; HelpURL: \\cern.ch\dfs\Applications\Altium\Datasheets\R0402_Phycomp_RC0402.pdf; Author: CERN DEM JLC; CreateDate: 03.12.2007; LatestRevisionDate: 17.10.2012
R32 = R0402_100R_1%_0.1W_100PPM: Resistor - 1%; Manufacturer Part Number: R0402_100R_1%_0.1W_100PPM_50V; Manufacturer: GENERIC; Part Description: General Purpose Thick Film Chip Resistor; Manufacturer1 Part Number: ERJ2RKF1000X; Power: 0.1W; TC: ±100ppm/°C; Voltage: 50V; PressFit: No; Part Number: R0402_100R_1%_0.1W_100PPM; Tolerance: ±1%; Value: 100; Component Kind: Standard; Component Type: Standard; Pin Count: 2; Status: Not Recommended; Case: 0402; Mounted: Yes; Sense: No; Socket: No; SMD: Yes; Manufacturer1 Example: PANASONIC; Manufacturer1 ComponentHeight: 0.4mm; HelpURL: \\cern.ch\dfs\Applications\Altium\Datasheets\R0402_PANASONIC_ERJ2RK.pdf; Author: CERN DEM JLC; CreateDate: 12.12.2013; LatestRevisionDate: 03.03.2015
R47 R169 = R0402_2K2_1%_0.0625W_100PPM: as R283 on sheet RTCE; Part Number: R0402_2K2_1%_0.0625W_100PPM; Component Kind: Standard; Component Type: Standard; Pin Count: 2; Value: 2k2; Status: Not recommended; Power: 0.0625W; Tolerance: ±1%; Manufacturer Part Number: R0402_2K2_1%_0.0625W_100PPM; Case: 0402; Mounted: Yes; Socket: No; SMD: Yes; Manufacturer1 Example: YAGEO PHYCOMP; Manufacturer1 ComponentHeight: 0.4mm; HelpURL: \\cern.ch\dfs\Applications\Altium\Datasheets\R0402_Phycomp_RC0402.pdf; Author: CERN DEM JLC; CreateDate: 2007-12-03; LatestRevisionDate: 2012-10-17
R127 = R0603_3K3_1%_0.1W_100PPM: Resistor - 1%; Part Description: General Purpose Thick Film Chip Resistor; Manufacturer: GENERIC; Manufacturer1 Part Number: NRC06F3301TRF; Power: 0.1W; TC: ±100ppm/°C; Table: Resistors SMD; Part Number: R0603_3K3_1%_0.1W_100PPM; Component Kind: Standard; Component Type: Standard; Pin Count: 2; Value: 3k3; Status: Preferred; Tolerance: ±1%; Manufacturer Part Number: R0603_3K3_1%_0.1W_100PPM; Case: 0603; Mounted: Yes; Socket: No; SMD: Yes; Manufacturer1 Example: NIC COMPONENT; Manufacturer1 ComponentHeight: 0.55mm; HelpURL: \\cern.ch\dfs\Applications\Altium\Datasheets\R0603_NIC_NRC.pdf; Author: CERN DEM JLC; CreateDate: 2007-12-03; LatestRevisionDate: 2008-03-13
R456 = R0402_3K9_1%_0.0625W_100PPM: Resistor - 1%; Part Description: General Purpose Thick Film Chip Resistor; Manufacturer: GENERIC; Manufacturer1 Part Number: 232270673902L; TC: ±100ppm/°C; PressFit: No; Part Number: R0402_3K9_1%_0.0625W_100PPM; Component Kind: Standard; Component Type: Standard; Pin Count: 2; Value: 3k9; Status: Not Recommended; Power: 0.0625W; Tolerance: ±1%; Manufacturer Part Number: R0402_3K9_1%_0.0625W_100PPM; Case: 0402; Mounted: Yes; Sense: No; Socket: No; SMD: Yes; Manufacturer1 Example: YAGEO PHYCOMP; Manufacturer1 ComponentHeight: 0.4mm; HelpURL: \\cern.ch\dfs\Applications\Altium\Datasheets\R0402_Phycomp_RC0402.pdf; Author: CERN DEM JLC; CreateDate: 03.12.2007; LatestRevisionDate: 17.10.2012
S1 = PB_ALPS_SKHHLQA010: Push-Button Switch SPDT; Manufacturer: ALPS; Part Description: 6x6mm, SPST Horizontal Pushbutton Switch, Stem height 8.35mm, Contact Rating 50mA 12VDC, SKHH Series; PressFit: No; Sense Comment: Non-washable; Manufacturer Part Number: SKHHLQA010; PackageDescription: Body 6x6mm, Stem height 8.35mm, Horizontal Pushbutton Switch, ALPS Serie SKHH; Part Number: PB_ALPS_SKHHLQA010; Component Kind: Standard; Component Type: Standard; Pin Count: 4; Family: Push Button; Mounted: Yes; Socket: No; SMD: No; Sense: Yes; Status: None; ComponentHeight: 7.4mm; HelpURL: \\cern.ch\dfs\Applications\Altium\Datasheets\PB_ALPS_SKHHLQA010.pdf; Author: CERN DEM JLC; CreateDate: 15.01.2009; LatestRevisionDate: 15.01.2009
SW1 = SW_TYCO_1571983-4: 4 Ways SPST DIP Switch; Manufacturer: TYCO; Part Description: 4 Way SPST SMD DIP Switch, Latched, Contact Rating 0.025A 24VDC; PressFit: No; PackageDescription: Pitch 1.27mm,  Body 6.2x6.2mm, 4 Ways SPST Surface-Mount DIP Switch, TYCO GDH Series; Part Number: SW_TYCO_1571983-4; Component Kind: Standard; Component Type: Standard; Pin Count: 8; Family: Switch; Mounted: Yes; Socket: No; SMD: Yes; Sense: No; Status: None; ComponentHeight: 2.31mm; HelpURL: \\cern.ch\dfs\Applications\Altium\Datasheets\SW_TYCO_1571983-4.pdf; Author: CERN DEM JLC; CreateDate: 08.01.2009; LatestRevisionDate: 08.01.2009
T9 T16 = BSS138LT1G: N-CHANNEL MOSFET WITH DIODE; Manufacturer: ON SEMICONDUCTOR; Part Description: 50V 200mA N-Channel Enhancement Mode Field-Effect Transistor; PressFit: No; Bonding: No; Manufacturer Part Number: BSS138LT1G; PackageDescription: SOT23 3-Leads, Pitch 0.95mm - Body 1.4x3mm, IPC Medium Density; Part Number: BSS138LT1G; Component Kind: Standard; Component Type: Standard; Device: BSS138LT1G; Pin Count: 3; Case: SOT23-3; Mounted: Yes; Socket: No; SMD: Yes; Sense: No; ComponentHeight: 1.11mm; HelpURL: \\cern.ch\dfs\Applications\Altium\Datasheets\BSS138LT1G.pdf; Author: CERN DEM JLC; CreateDate: 23.03.2009; LatestRevisionDate: 23.03.2009
X1 = XTAL_8MHZ_TXC_7A-8.000MAAE-T: Quartz Crystal; Manufacturer: TXC CORPORATION; Part Description: Tolerance: ±30ppm, Stability: ±30ppm, -20°C to +70°C, 12pF, SMD Glass Seam Sealing Crystal, 7A Series; PressFit: No; Bonding: No; Manufacturer Part Number: 7A-8.000MAAE-T; PackageDescription: 2 Pins, 3.2x5mm, SMD Glass Seam Sealing Crystal, 7A Serie; Part Number: XTAL_8MHZ_TXC_7A-8.000MAAE-T; Value: 8MHz; Component Kind: Standard; Component Type: Standard; Pin Count: 2; Mounted: Yes; Socket: No; SMD: Yes; Sense: No; ComponentHeight: 1.2mm; HelpURL: \\cern.ch\dfs\Applications\Altium\Datasheets\XTAL_TXC_7A.pdf; Author: CERN DEM JLC; CreateDate: 09.10.2014; LatestRevisionDate: 12.11.2014